# EAGLE schematic FS20SM8_DFF_Relais (EAGLE 7.3.0)
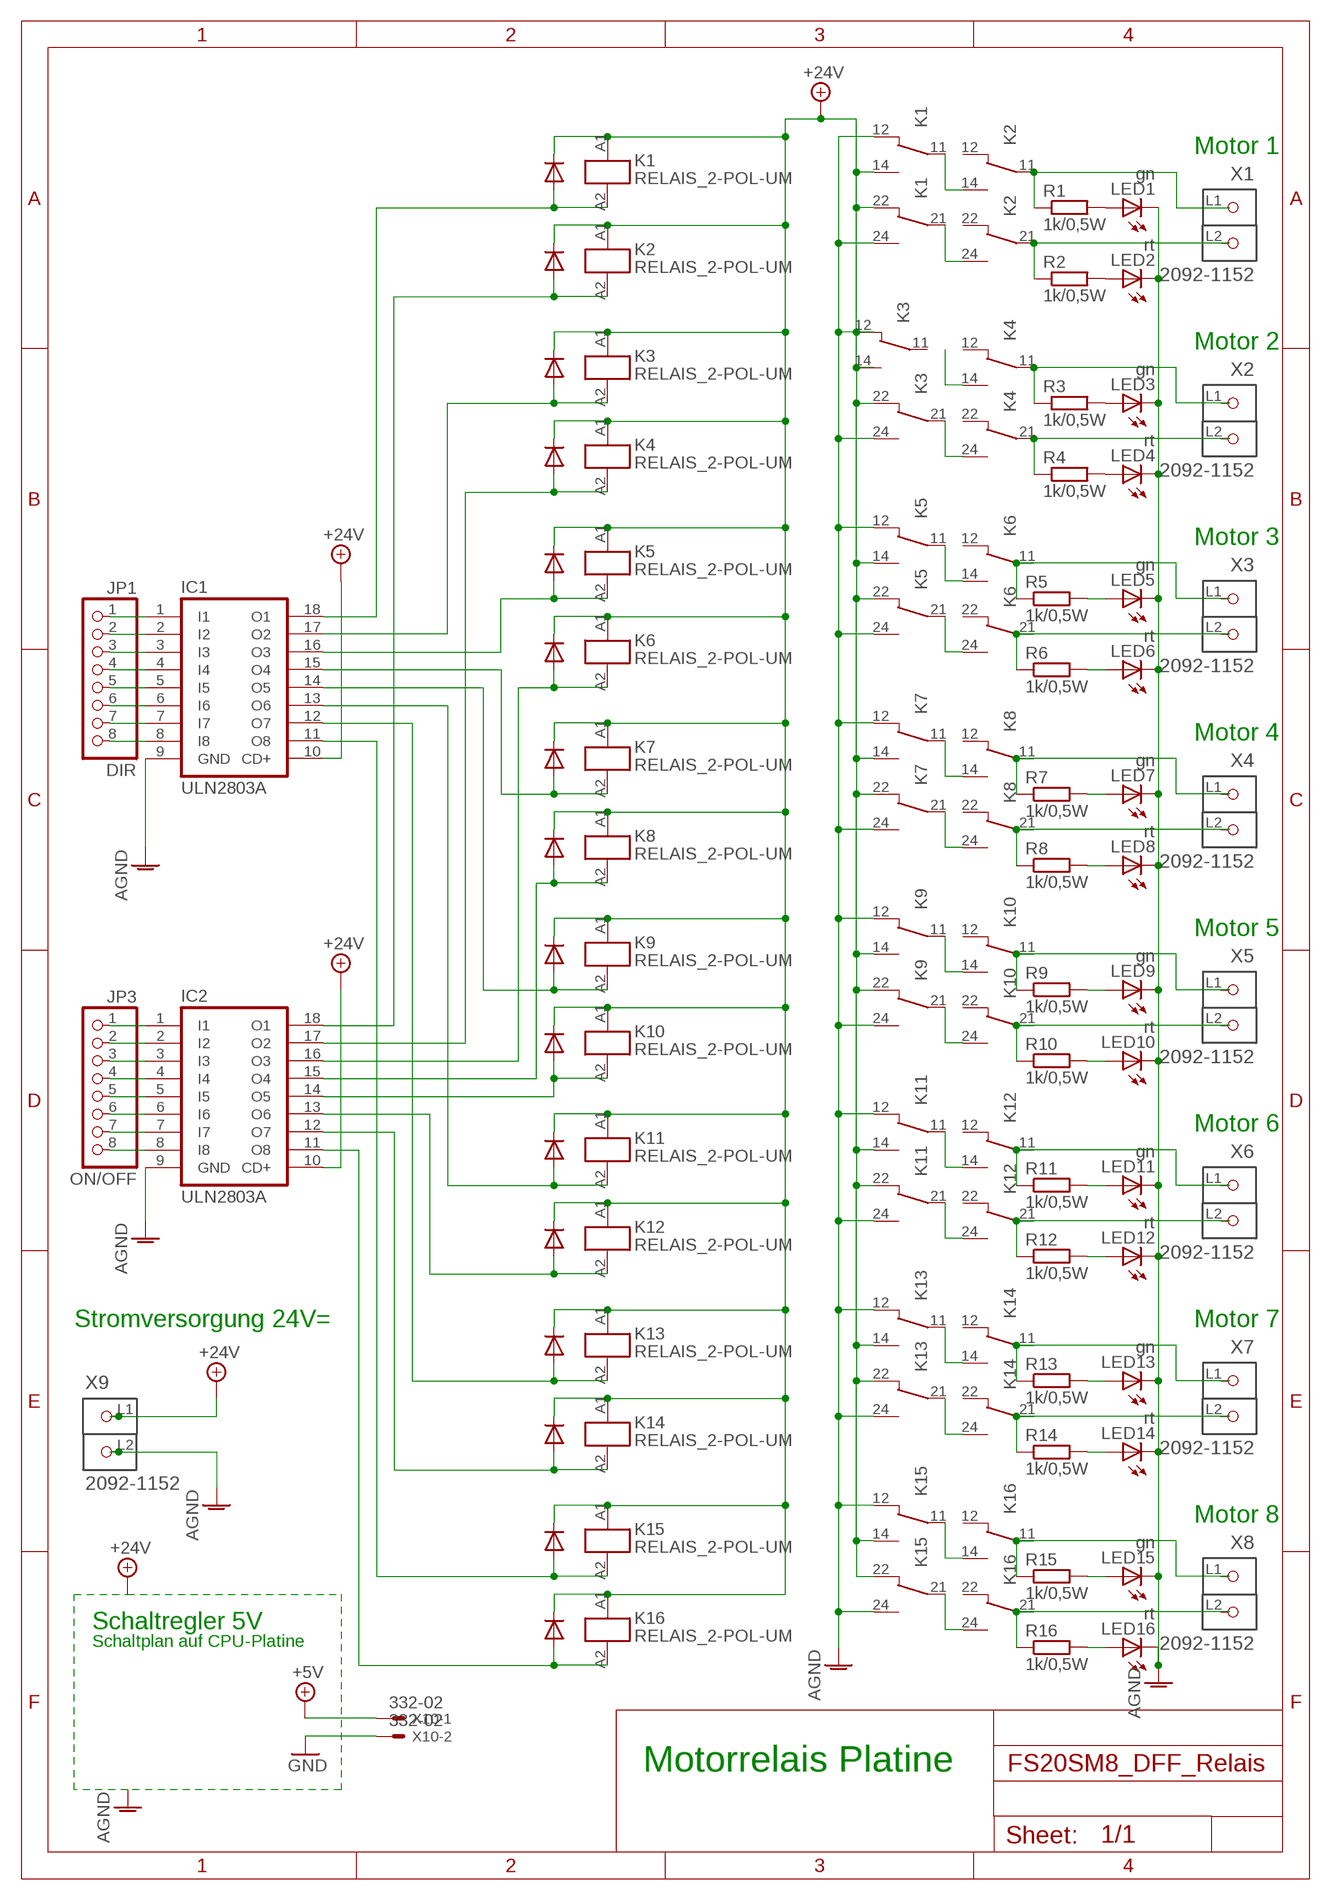
[diagram p0: schematic, sheet 1]

## Parts
IC1  ULN2803A  [DIL18]
IC2  ULN2803A  [DIL18]
JP1  DIR  PINHD-1X8  [1X08]
JP3  ON/OFF  PINHD-1X8  [1X08]
K1  RELAIS_2-POL-UM  [RELAIS_2-POL-UM]
K2  RELAIS_2-POL-UM  [RELAIS_2-POL-UM]
K3  RELAIS_2-POL-UM  [RELAIS_2-POL-UM]
K4  RELAIS_2-POL-UM  [RELAIS_2-POL-UM]
K5  RELAIS_2-POL-UM  [RELAIS_2-POL-UM]
K6  RELAIS_2-POL-UM  [RELAIS_2-POL-UM]
K7  RELAIS_2-POL-UM  [RELAIS_2-POL-UM]
K8  RELAIS_2-POL-UM  [RELAIS_2-POL-UM]
K9  RELAIS_2-POL-UM  [RELAIS_2-POL-UM]
K10  RELAIS_2-POL-UM  [RELAIS_2-POL-UM]
K11  RELAIS_2-POL-UM  [RELAIS_2-POL-UM]
K12  RELAIS_2-POL-UM  [RELAIS_2-POL-UM]
K13  RELAIS_2-POL-UM  [RELAIS_2-POL-UM]
K14  RELAIS_2-POL-UM  [RELAIS_2-POL-UM]
K15  RELAIS_2-POL-UM  [RELAIS_2-POL-UM]
K16  RELAIS_2-POL-UM  [RELAIS_2-POL-UM]
LED1  gn  LED3MM  [LED3MM]
LED2  rt  LED3MM  [LED3MM]
LED3  gn  LED3MM  [LED3MM]
LED4  rt  LED3MM  [LED3MM]
LED5  gn  LED3MM  [LED3MM]
LED6  rt  LED3MM  [LED3MM]
LED7  gn  LED3MM  [LED3MM]
LED8  rt  LED3MM  [LED3MM]
LED9  gn  LED3MM  [LED3MM]
LED10  rt  LED3MM  [LED3MM]
LED11  gn  LED3MM  [LED3MM]
LED12  rt  LED3MM  [LED3MM]
LED13  gn  LED3MM  [LED3MM]
LED14  rt  LED3MM  [LED3MM]
LED15  gn  LED3MM  [LED3MM]
LED16  rt  LED3MM  [LED3MM]
R1  1k/0,5W  R-EU_0207/2V  [0207/2V]
R2  1k/0,5W  R-EU_0207/2V  [0207/2V]
R3  1k/0,5W  R-EU_0207/2V  [0207/2V]
R4  1k/0,5W  R-EU_0207/2V  [0207/2V]
R5  1k/0,5W  R-EU_0207/2V  [0207/2V]
R6  1k/0,5W  R-EU_0207/2V  [0207/2V]
R7  1k/0,5W  R-EU_0207/2V  [0207/2V]
R8  1k/0,5W  R-EU_0207/2V  [0207/2V]
R9  1k/0,5W  R-EU_0207/2V  [0207/2V]
R10  1k/0,5W  R-EU_0207/2V  [0207/2V]
R11  1k/0,5W  R-EU_0207/2V  [0207/2V]
R12  1k/0,5W  R-EU_0207/2V  [0207/2V]
R13  1k/0,5W  R-EU_0207/2V  [0207/2V]
R14  1k/0,5W  R-EU_0207/2V  [0207/2V]
R15  1k/0,5W  R-EU_0207/2V  [0207/2V]
R16  1k/0,5W  R-EU_0207/2V  [0207/2V]
X1  2092-1152  [P-2092-1152]
X2  2092-1152  [P-2092-1152]
X3  2092-1152  [P-2092-1152]
X4  2092-1152  [P-2092-1152]
X5  2092-1152  [P-2092-1152]
X6  2092-1152  [P-2092-1152]
X7  2092-1152  [P-2092-1152]
X8  2092-1152  [P-2092-1152]
X9  2092-1152  [P-2092-1152]
X10  332-02  [332-02]

## Nets
+5V: X10.1
+24V: IC1.10(CD+) IC2.10(CD+) K1.14 K1.22 K1.A1 K2.A1 K3.12 K3.14 K3.22 K3.A1 K4.A1 K5.14 K5.22 K5.A1 K6.A1 K7.14 K7.22 K7.A1 K8.A1 K9.14 K9.22 K9.A1 K10.A1 K11.14 K11.22 K11.A1 K12.A1 K13.14 K13.22 K13.A1 K14.A1 K15.14 K15.22 K15.A1 X9.L1(P1)
AGND: IC1.9(GND) IC2.9(GND) K1.12 K1.24 K3.24 K5.12 K5.24 K7.12 K7.24 K9.12 K9.24 K11.12 K11.24 K13.12 K13.24 K15.12 K15.24 LED1.K(C) LED2.K(C) LED3.K(C) LED4.K(C) LED5.K(C) LED6.K(C) LED7.K(C) LED8.K(C) LED9.K(C) LED10.K(C) LED11.K(C) LED12.K(C) LED13.K(C) LED14.K(C) LED15.K(C) LED16.K(C) X9.L2(P2)
GND: X10.2
N$1: K1.11 K2.14
N$2: IC2.18(O1) K2.A2
N$3: IC1.18(O1) K1.A2
N$4: K1.21 K2.24
N$5: IC1.17(O2) K3.A2
N$6: IC2.17(O2) K4.A2
N$7: IC1.16(O3) K5.A2
N$8: IC2.16(O3) K6.A2
N$9: IC1.15(O4) K7.A2
N$10: IC2.15(O4) K8.A2
N$11: K4.11 R3.1
N$12: K2.11 R1.1
N$13: K2.21 R2.1
N$14: K4.21 R4.1
N$15: K4.14
N$16: K3.21 K4.24
N$17: K6.11 R5.1
N$18: K6.21 R6.1
N$19: K5.11 K6.14
N$20: K5.21 K6.24
N$21: K8.11 R7.1
N$22: K8.21 R8.1
N$23: K7.11 K8.14
N$24: K7.21 K8.24
N$25: IC1.14(O5) K9.A2
N$26: IC2.14(O5) K10.A2
N$27: IC1.13(O6) K11.A2
N$28: IC2.13(O6) K12.A2
N$29: IC1.12(O7) K13.A2
N$30: IC2.12(O7) K14.A2
N$31: IC1.11(O8) K15.A2
N$32: IC2.11(O8) K16.A2
N$33: K10.11 R9.1
N$34: K10.21 R10.1
N$35: K9.11 K10.14
N$36: K9.21 K10.24
N$37: K12.11 R11.1
N$38: K12.21 R12.1
N$39: K11.11 K12.14
N$40: K11.21 K12.24
N$41: K14.11 R13.1
N$42: K14.21 R14.1
N$43: K13.11 K14.14
N$44: K13.21 K14.24
N$45: K16.11 R15.1
N$46: K16.21 R16.1
N$47: K15.11 K16.14
N$48: K15.21 K16.24
N$49: K16.A1
N$50: LED1.A R1.2
N$51: LED2.A R2.2
N$52: LED3.A R3.2
N$53: LED4.A R4.2
N$54: LED5.A R5.2
N$55: LED6.A R6.2
N$56: LED7.A R7.2
N$57: LED8.A R8.2
N$58: LED9.A R9.2
N$59: LED10.A R10.2
N$60: LED11.A R11.2
N$61: LED12.A R12.2
N$62: LED13.A R13.2
N$63: LED14.A R14.2
N$64: LED15.A R15.2
N$65: LED16.A R16.2
N$66: IC1.1(I1) JP1.1
N$67: IC1.2(I2) JP1.2
N$68: IC1.3(I3) JP1.3
N$69: IC1.4(I4) JP1.4
N$70: IC1.5(I5) JP1.5
N$71: IC1.6(I6) JP1.6
N$72: IC1.7(I7) JP1.7
N$73: IC1.8(I8) JP1.8
N$74: IC2.1(I1) JP3.1
N$75: IC2.2(I2) JP3.2
N$76: IC2.3(I3) JP3.3
N$77: IC2.4(I4) JP3.4
N$78: IC2.5(I5) JP3.5
N$79: IC2.6(I6) JP3.6
N$80: IC2.7(I7) JP3.7
N$81: IC2.8(I8) JP3.8
Unconnected: K2.12 K2.22 K3.11 K4.12 K4.22 K6.12 K6.22 K8.12 K8.22 K10.12 K10.22 K12.12 K12.22 K14.12 K14.22 K16.12 K16.22 X1.L1(P1) X1.L2(P2) X2.L1(P1) X2.L2(P2) X3.L1(P1) X3.L2(P2) X4.L1(P1) X4.L2(P2) X5.L1(P1) X5.L2(P2) X6.L1(P1) X6.L2(P2) X7.L1(P1) X7.L2(P2) X8.L1(P1) X8.L2(P2)

## Notes on the sheet
- Motor 1
- Motor 2
- Motor 3
- Motor 4
- Motor 5
- Motor 6
- Stromversorgung 24V= | Motor 7
- Motor 8
- Schaltregler 5V
- Schaltplan auf CPU-Platine
- Motorrelais Platine

## Library data of the parts
IC1 IC2 = uln-udn:ULN2803A: DRIVER ARRAY
JP1 JP3 = pinhead:PINHD-1X8: PIN HEADER
K1 K3 K5 K7 K9 K11 K13 K15 = e-schuetze-relais:RELAIS_2-POL-UM: Relais mit 2 Wechsleschalter; FUNKTION: Richtung; HERSTELLER: Finder; TYPE: FIN 41.52.9 24V
K2 K4 K6 K8 K10 K12 K14 K16 = e-schuetze-relais:RELAIS_2-POL-UM: Relais mit 2 Wechsleschalter; FUNKTION: Ein/Aus; HERSTELLER: Finder; TYPE: FIN 41.52.9 24V
LED1-LED16 = led:LED: LED OSRAM: - CHIPLED LG R971, LG N971, LY N971, LG Q971, LY Q971, LO R971, LY R971 LH N974, LH R974 LS Q976, LO Q976, LY Q976 LO Q996 - Hyper CHIPLED LW Q18S LB Q993, LB Q99A, LB R99A - SideLED LS A670, LO A670, LY A670, LG A670, LP A670 LB A673, LV A673, LT A673, LW A673 LH A674 LY A675 LS A676, LA A676, LO A676, LY A676, LW A676 LS A679, LY A679, LG A679 - Hyper Micro SIDELED® LS Y876, LA Y876, LO Y876, LY Y876 LT Y87S - SmartLED LW L88C, LW L88S LB L89C, LB L89S, LG L890 LS L89K, LO L89K, LY L89K LS L896, LA L896, LO L896, LY L896 - TOPLED LS T670, LO T670, LY T670, LG T670, LP T670 LSG T670, LSP T670, LSY T670, LOP T670, LYG T670 LG T671, LOG T671, LSG T671 LB T673, LV T673, LT T673, LW T673 LH T674 LS T676, LA T676, LO T676, LY T676, LB T676, LH T676, LSB T676, LW T676 LB T67C, LV T67C, LT T67C, LS T67K, LO T67K, LY T67K, LW E67C LS E67B, LA E67B, LO E67B, LY E67B, LB E67C, LV E67C, LT E67C LW T67C LS T679, LY T679, LG T679 LS T770, LO T770, LY T770, LG T770, LP T770 LB T773, LV T773, LT T773, LW T773 LH T774 LS E675, LA E675, LY E675, LS T675 LS T776, LA T776, LO T776, LY T776, LB T776 LHGB T686 LT T68C, LB T68C - Hyper Mini TOPLED® LB M676 - Mini TOPLED Santana® LG M470 LS M47K, LO M47K, LY M47K Source: http://www.osram.convergy.de LUXEON: - LUMILED® LXK2-PW12-R00, LXK2-PW12-S00, LXK2-PW14-U00, LXK2-PW14-V00 LXK2-PM12-R00, LXK2-PM12-S00, LXK2-PM14-U00 LXK2-PE12-Q00, LXK2-PE12-R00, LXK2-PE12-S00, LXK2-PE14-T00, LXK2-PE14-U00 LXK2-PB12-K00, LXK2-PB12-L00, LXK2-PB12-M00, LXK2-PB14-N00, LXK2-PB14-P00, LXK2-PB14-Q00 LXK2-PR12-L00, LXK2-PR12-M00, LXK2-PR14-Q00, LXK2-PR14-R00 LXK2-PD12-Q00, LXK2-PD12-R00, LXK2-PD12-S00 LXK2-PH12-R00, LXK2-PH12-S00 LXK2-PL12-P00, LXK2-PL12-Q00, LXK2-PL12-R00 Source: www.luxeon.com KINGBRIGHT: KA-3528ASYC Source: www.kingbright.com
R1-R16 = resistor:R-EU_: RESISTOR, European symbol
X1-X9 = con-wago_5.0mm:2092-1152: Serie 2092, Federleiste eCOM mit geraden Lötstiften mit Griffplatte / Series 2092, eCOM pluggable PCB connector with straight solder pins with gripping plate Polzahl / Pole No.: 2 Rastermaß / Pitch: 5 mm Bemessungsspannung / Rated Voltage: 320 V Nennstrom / Nominal Current: 16 A Leiterquerschnitt / Conductor Size: 0.2 - 2.5 mm² Anschlusstechnik / Connection Technology: CAGE CLAMP® S Lötstiftlänge: / Solder Pin Length: 3.6 mm Farbe / Color: lichtgrau / light gray Stand: 01.01.2014. Die jeweils aktuellen Daten zu diesem Artikel finden Sie in unserem Produktkatalog, den Sie unter www.wago.com einsehen können. As of: 01/01/2014. Please find the newest data for this article in our product catalogue, which can be viewed under www.wago.com.
X10 = con-garry:332-02: 2 Pin - 2mm Dual Row Source: www.mpe-connector.de / garry_shortform_2012.pdf